# Altium schematic sheet Shore Power.SchDoc
size A4
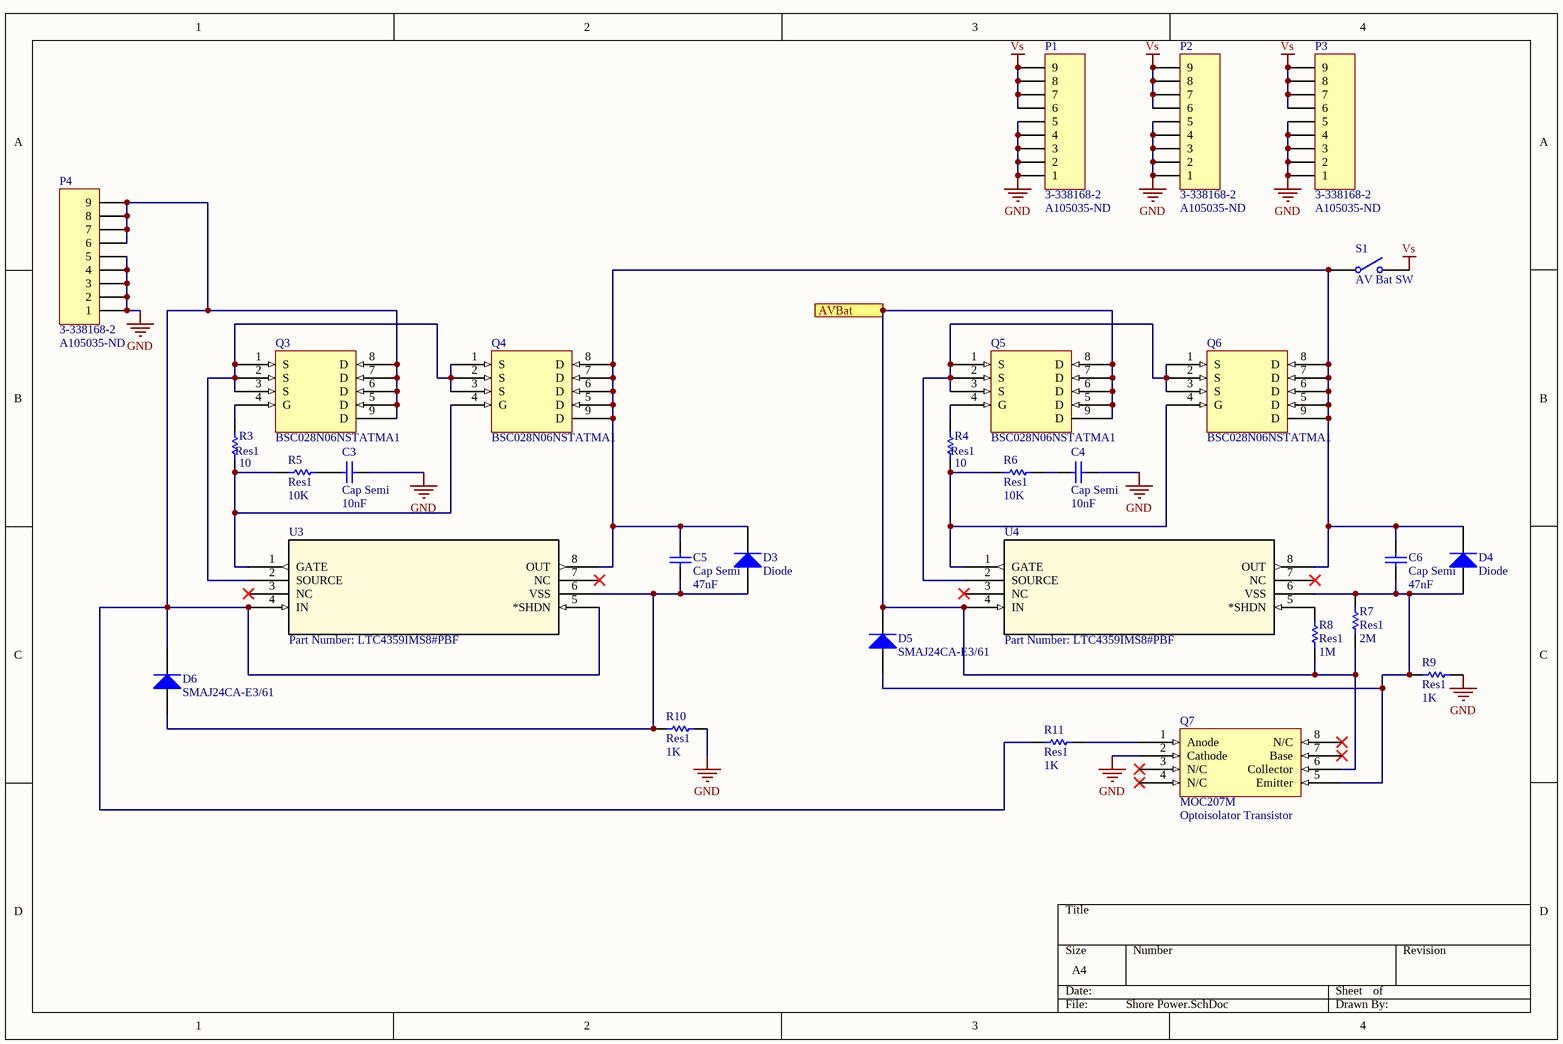
[diagram p0: Shore Power.SchDoc]

## Parts
C3  Cap Semi  value 10nF  [C1206]
C4  Cap Semi  value 10nF  [C1206]
C5  Cap Semi  value 47nF  [C1206]
C6  Cap Semi  value 47nF  [C1206]
D3  Diode  [DIOM4427X27N]
D4  Diode  [DIOM4427X27N]
D5  SMAJ24CA-E3/61  [DIODE_DO-214AC]
D6  SMAJ24CA-E3/61  [DIODE_DO-214AC]
P1  3-338168-2  Supplier Part Number 1: A105035-ND  [CONN_3-338168-2]
P2  3-338168-2  Supplier Part Number 1: A105035-ND  [CONN_3-338168-2]
P3  3-338168-2  Supplier Part Number 1: A105035-ND  [CONN_3-338168-2]
P4  3-338168-2  Supplier Part Number 1: A105035-ND  [CONN_3-338168-2]
Q3  BSC028N06NSTATMA1  [FDMS86101A]
Q4  BSC028N06NSTATMA1  [FDMS86101A]
Q5  BSC028N06NSTATMA1  [FDMS86101A]
Q6  BSC028N06NSTATMA1  [FDMS86101A]
Q7  MOC207M  [SOIC127P590X363-8N]
R3  Res1  value 10  [6-0805_L]
R4  Res1  value 10  [6-0805_L]
R5  Res1  value 10K  [6-0805_L]
R6  Res1  value 10K  [6-0805_L]
R7  Res1  value 2M  [J1-0603]
R8  Res1  value 1M  [J1-0603]
R9  Res1  value 1K  [STA_RMCF2512]
R10  Res1  value 1K  [STA_RMCF2512]
R11  Res1  value 1K  [STA_RMCF2512]
S1  AV Bat SW  [M80-5000000M5-02-333-00-000]
U3  Part Number: LTC4359IMS8#PBF  [MSOP-8_MS]
U4  Part Number: LTC4359IMS8#PBF  [MSOP-8_MS]

## Ports
AVBat

## Nets
GND: C3.1 C4.1 P1.1 P1.2 P1.3 P1.4 P1.5 P2.1 P2.2 P2.3 P2.4 P2.5 P3.1 P3.2 P3.3 P3.4 P3.5 P4.1 P4.2 P4.3 P4.4 P4.5 Q7.2(Cathode) R9.1 R10.1
Vs: P1.6 P1.7 P1.8 P1.9 P2.6 P2.7 P2.8 P2.9 P3.6 P3.7 P3.8 P3.9 S1.2(NO)
AVBat: D5.2(K) Q5.5(D) Q5.6(D) Q5.7(D) Q5.8(D) Q5.9(D) Q7.6(Collector) R7.1 R8.2 U4.4(IN) ; port AVBat
NetC3_2: C3.2 R5.2
NetC4_2: C4.2 R6.2
NetC5_1: C5.1 C6.1 D3.2(K) D4.2(K) Q4.5(D) Q4.6(D) Q4.7(D) Q4.8(D) Q4.9(D) Q6.5(D) Q6.6(D) Q6.7(D) Q6.8(D) Q6.9(D) S1.1(COMMON) U3.8(OUT) U4.8(OUT)
NetC5_2: C5.2 D3.1(A) D6.1(A) R10.2 U3.6(VSS)
NetC6_2: C6.2 D4.1(A) D5.1(A) Q7.5(Emitter) R7.2 R9.2 U4.6(VSS)
NetD6_2: D6.2(K) P4.6 P4.7 P4.8 P4.9 Q3.5(D) Q3.6(D) Q3.7(D) Q3.8(D) Q3.9(D) R11.2 U3.4(IN) U3.5(*SHDN)
NetQ3_1: Q3.1(S) Q3.2(S) Q3.3(S) Q4.1(S) Q4.2(S) Q4.3(S) U3.2(SOURCE)
NetQ3_4: Q3.4(G) R3.2
NetQ4_4: Q4.4(G) R3.1 R5.1 U3.1(GATE)
NetQ5_1: Q5.1(S) Q5.2(S) Q5.3(S) Q6.1(S) Q6.2(S) Q6.3(S) U4.2(SOURCE)
NetQ5_4: Q5.4(G) R4.2
NetQ6_4: Q6.4(G) R4.1 R6.1 U4.1(GATE)
NetQ7_1: Q7.1(Anode) R11.1
NetR8_1: R8.1 U4.5(*SHDN)

Not connected (* = marked no-connect by the designer): Q7 3(N/C)* 4(N/C)* 7(Base)* 8(N/C)*; U3 3(NC)* 7(NC)*; U4 3(NC)* 7(NC)*

## Library data of the parts
C3-C6 = Cap Semi: Capacitor (Semiconductor SIM Model); Published: 8-Jun-2000; LatestRevisionDate: 29-May-2009; LatestRevisionNote: IPC-7351 Footprint Added.; PackageReference: C1206; Publisher: Altium Limited; PackageDescription: Chip Capacitor
  C3 C4: Supplier Part Number: 1276-2735-1-ND
  C5 C6: Supplier Part Number: 311-4451-1-ND
D3 D4 = Diode: Default Diode; pin to pad: 1>2 2>1; Published: 8-Jun-2000; LatestRevisionDate: 17-Jul-2002; LatestRevisionNote: Re-released for DXP Platform.; PackageVersion: Sep-1996; PackageReference: SMC; Publisher: Altium Limited; PackageDescription: DO-214-AB/SMC; 2 C-Bend Leads; Body 7.9 x 5.9 mm, inc. leads (LxW); Code_JEDEC: DO-214-AB
D5 D6 = Diode: Default Diode; SPN: SMAJ24CA-E3/61GICT-ND; Published: 8-Jun-2000; LatestRevisionDate: 17-Jul-2002; LatestRevisionNote: Re-released for DXP Platform.; PackageVersion: Sep-1996; PackageReference: SMC; Publisher: Altium Limited; PackageDescription: DO-214-AB/SMC; 2 C-Bend Leads; Body 7.9 x 5.9 mm, inc. leads (LxW); Code_JEDEC: DO-214-AB
P1-P4 = Header 9: Header, 9-Pin; LatestRevisionDate: 17-Jul-2002; LatestRevisionNote: Re-released for DXP Platform.; Publisher: Altium Limited; MPN: 3-338168-2; SPN: A105035-ND; Supplier 1: Digi-Key
Q3-Q6 = FDMS86101A: MOSFET N-CH 100V 13A POWER56; SPN: BSC028N06NSTATMA1CT-ND
Q7 = MOC207M: Optoisolator Transistor; SPN: MOC207M-ND; Desc: Optoisolator Transistor
R3 R4 = Res1: Resistor; SPN: RHM10.0AECT-ND; Published: 8-Jun-2000; LatestRevisionDate: 17-Jul-2002; LatestRevisionNote: Re-released for DXP Platform.; PackageReference: AXIAL-0.3; Publisher: Altium Limited; PackageDescription: Axial Device, Thru-Hole; 2 Leads; 0.3 in Pin Spacing
R5 R6 = Res1: Resistor; SPN: RNCP0805FTD10K0CT-ND; Published: 8-Jun-2000; LatestRevisionDate: 17-Jul-2002; LatestRevisionNote: Re-released for DXP Platform.; PackageReference: AXIAL-0.3; Publisher: Altium Limited; PackageDescription: Axial Device, Thru-Hole; 2 Leads; 0.3 in Pin Spacing
R7 = Res1: Resistor; SPN: RHM2MDCT-ND; Published: 8-Jun-2000; LatestRevisionDate: 17-Jul-2002; LatestRevisionNote: Re-released for DXP Platform.; PackageReference: AXIAL-0.3; Publisher: Altium Limited; PackageDescription: Axial Device, Thru-Hole; 2 Leads; 0.3 in Pin Spacing
R8 = Res1: Resistor; SPN: RHM1MDCT-ND; Published: 8-Jun-2000; LatestRevisionDate: 17-Jul-2002; LatestRevisionNote: Re-released for DXP Platform.; PackageReference: AXIAL-0.3; Publisher: Altium Limited; PackageDescription: Axial Device, Thru-Hole; 2 Leads; 0.3 in Pin Spacing
R9-R11 = Res1: Resistor; SPN: RMCF2512JT1K00CT-ND; Published: 8-Jun-2000; LatestRevisionDate: 17-Jul-2002; LatestRevisionNote: Re-released for DXP Platform.; PackageReference: AXIAL-0.3; Publisher: Altium Limited; PackageDescription: Axial Device, Thru-Hole; 2 Leads; 0.3 in Pin Spacing
S1 = SW-SPST: Single-Pole, Single-Throw Switch; Published: 24-Mar-1999; LatestRevisionDate: 17-Jul-2002; LatestRevisionNote: Re-released for DXP Platform.; PackageReference: SPST-2; Publisher: Altium Limited; PackageDescription: Switch; 2 Leads
U3 U4 = LTC4359IMS8#PBF: No Description Available; Vendor: Linear Technology; Built_By: EMA_UL_Team; Manufacturer_Part_Number: LTC4359IMS8#PBF; Copyright: Copyright (C) 2018 Accelerated Designs. All rights reserved; RefDes: RefDes; Type: DEV; Value: Value